# EAGLE design device (EAGLE 6.6.0)
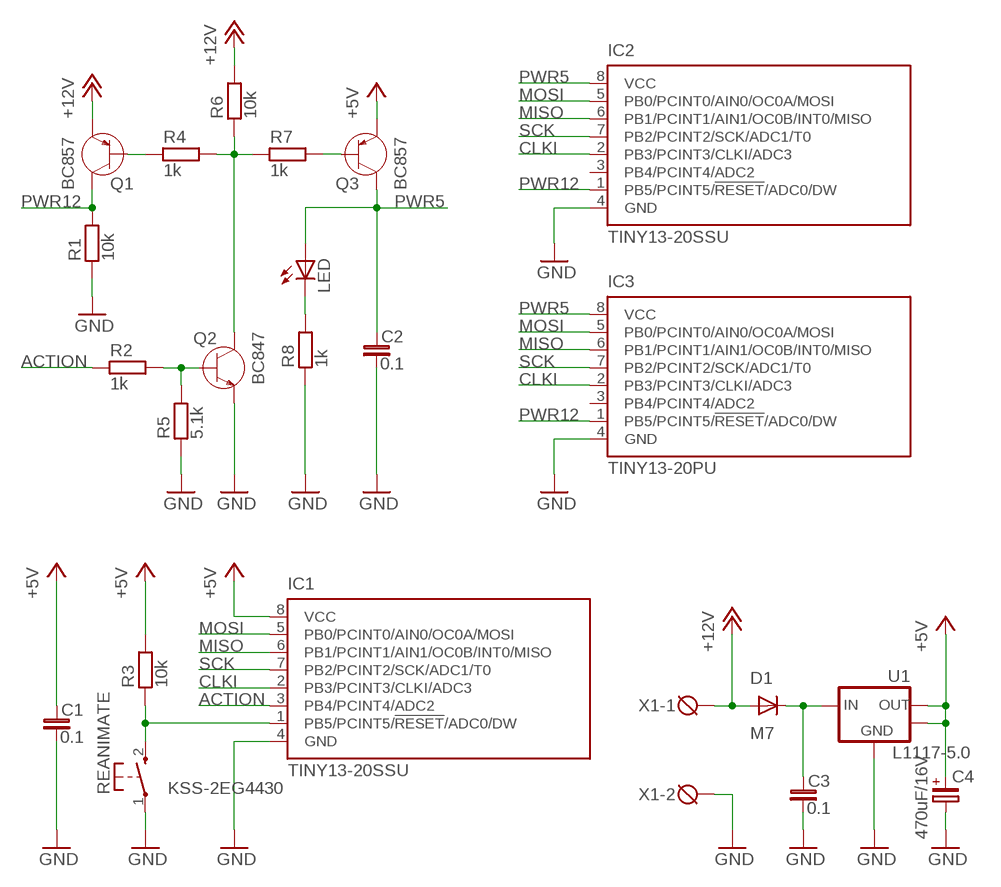
[diagram p0: schematic, sheet 1]

## Parts
C1  0.1  C_0805  [C0805]
C2  0.1  C_0805  [C0805]
C3  0.1  C_0805  [C0805]
C4  470uF/16V  CP_BC175TMP-0810  [C175TMP-0810]
D1  M7  DIODE-DO214AC  [DO214AC]
IC1  TINY13-20SSU  [8S1]
IC2  TINY13-20SSU  [8S1]
IC3  TINY13-20PU  [DIL08]
LED  LEDCHIPLED_0805  [CHIPLED_0805]
Q1  BC857  PNP-SOT23  [SOT23]
Q2  BC847  NPN-SOT23  [SOT23]
Q3  BC857  PNP-SOT23  [SOT23]
R1  10k  R_0805  [R0805]
R2  1k  R_0805  [R0805]
R3  10k  R_0805  [R0805]
R4  1k  R_0805  [R0805]
R5  5.1k  R_0805  [R0805]
R6  10k  R_0805  [R0805]
R7  1k  R_0805  [R0805]
R8  1k  R_0805  [R0805]
REANIMATE  KSS-2EG4430  [KSS-2EG4430]
U1  L1117-5.0  LM1117-3.3  [SOT223]
X1  DG3XX-02-5.0  [DG306-5.0-02P]

## Nets
+5V: C1.1 C4.+ IC1.8(VCC) Q3.2(E) R3.2 U1.2(OUT) U1.4(MASS)
+12V: D1.A Q1.2(E) R6.2 X1.1
ACTION: IC1.3(PB4/PCINT4/ADC2) R2.1
CLKI: IC1.2(PB3/PCINT3/CLKI/ADC3) IC2.2(PB3/PCINT3/CLKI/ADC3) IC3.2(PB3/PCINT3/CLKI/ADC3)
GND: C1.2 C2.2 C3.2 C4.- IC1.4(GND) IC2.4(GND) IC3.4(GND) Q2.2(E) R1.1 R5.1 R8.1 REANIMATE.1(P) U1.1(GND) X1.2
MISO: IC1.6(PB1/PCINT1/AIN1/OC0B/INT0/MISO) IC2.6(PB1/PCINT1/AIN1/OC0B/INT0/MISO) IC3.6(PB1/PCINT1/AIN1/OC0B/INT0/MISO)
MOSI: IC1.5(PB0/PCINT0/AIN0/OC0A/MOSI) IC2.5(PB0/PCINT0/AIN0/OC0A/MOSI) IC3.5(PB0/PCINT0/AIN0/OC0A/MOSI)
N$1: IC1.1(PB5/PCINT5/!RESET!/ADC0/DW) R3.1 REANIMATE.2(S)
N$2: C3.1 D1.C U1.3(IN)
N$3: Q2.1(B) R2.2 R5.2
N$4: Q1.1(B) R4.1
N$5: Q3.1(B) R7.2
N$6: LED.C R8.2
N$8: Q2.3(C) R4.2 R6.1 R7.1
PWR5: C2.1 IC2.8(VCC) IC3.8(VCC) LED.A Q3.3(C)
PWR12: IC2.1(PB5/PCINT5/!RESET!/ADC0/DW) IC3.1(PB5/PCINT5/!RESET!/ADC0/DW) Q1.3(C) R1.2
SCK: IC1.7(PB2/PCINT2/SCK/ADC1/T0) IC2.7(PB2/PCINT2/SCK/ADC1/T0) IC3.7(PB2/PCINT2/SCK/ADC1/T0)
Unconnected: IC2.3(PB4/PCINT4/ADC2) IC3.3(PB4/PCINT4/ADC2)

## Library data of the parts
C1-C3 = rc-master-smd:C_: NON-POLARIZED CAP
C4 = rc-master:CP_: POLARIZED CAP
D1 = diode:DIODE-: DIODE
IC1-IC3 = avr:TINY13: 8-bit AVR Microcontroller with 1K Bytes In-System Programmable Flash Source: http://www.atmel.com/dyn/resources/prod_documents/2535S.pdf
LED = led:LED: LED OSRAM: - CHIPLED LG R971, LG N971, LY N971, LG Q971, LY Q971, LO R971, LY R971 LH N974, LH R974 LS Q976, LO Q976, LY Q976 LO Q996 - Hyper CHIPLED LW Q18S LB Q993, LB Q99A, LB R99A - SideLED LS A670, LO A670, LY A670, LG A670, LP A670 LB A673, LV A673, LT A673, LW A673 LH A674 LY A675 LS A676, LA A676, LO A676, LY A676, LW A676 LS A679, LY A679, LG A679 - Hyper Micro SIDELED® LS Y876, LA Y876, LO Y876, LY Y876 LT Y87S - SmartLED LW L88C, LW L88S LB L89C, LB L89S, LG L890 LS L89K, LO L89K, LY L89K LS L896, LA L896, LO L896, LY L896 - TOPLED LS T670, LO T670, LY T670, LG T670, LP T670 LSG T670, LSP T670, LSY T670, LOP T670, LYG T670 LG T671, LOG T671, LSG T671 LB T673, LV T673, LT T673, LW T673 LH T674 LS T676, LA T676, LO T676, LY T676, LB T676, LH T676, LSB T676, LW T676 LB T67C, LV T67C, LT T67C, LS T67K, LO T67K, LY T67K, LW E67C LS E67B, LA E67B, LO E67B, LY E67B, LB E67C, LV E67C, LT E67C LW T67C LS T679, LY T679, LG T679 LS T770, LO T770, LY T770, LG T770, LP T770 LB T773, LV T773, LT T773, LW T773 LH T774 LS E675, LA E675, LY E675, LS T675 LS T776, LA T776, LO T776, LY T776, LB T776 LHGB T686 LT T68C, LB T68C - Hyper Mini TOPLED® LB M676 - Mini TOPLED Santana® LG M470 LS M47K, LO M47K, LY M47K Source: http://www.osram.convergy.de - LUMILED® LXK2-PW12-R00, LXK2-PW12-S00, LXK2-PW14-U00, LXK2-PW14-V00 LXK2-PM12-R00, LXK2-PM12-S00, LXK2-PM14-U00 LXK2-PE12-Q00, LXK2-PE12-R00, LXK2-PE12-S00, LXK2-PE14-T00, LXK2-PE14-U00 LXK2-PB12-K00, LXK2-PB12-L00, LXK2-PB12-M00, LXK2-PB14-N00, LXK2-PB14-P00, LXK2-PB14-Q00 LXK2-PR12-L00, LXK2-PR12-M00, LXK2-PR14-Q00, LXK2-PR14-R00 LXK2-PD12-Q00, LXK2-PD12-R00, LXK2-PD12-S00 LXK2-PH12-R00, LXK2-PH12-S00 LXK2-PL12-P00, LXK2-PL12-Q00, LXK2-PL12-R00 Source: www.luxeon.com
Q1 Q3 = semiconductor:PNP-
Q2 = semiconductor:NPN-: Bipolar transistor NPN-structure
R1-R8 = rc-master-smd:R_: RESISTOR
REANIMATE = buttons:KSS-2EG4430: Size: 3x6mm Height: 5mm from PCB Rating: DC12v 50mA Travel: 0.25±0.10mm Operating Force: 180±50gf Return Force: 60gf min Contact resistance: 100m? max Insulation resistance: 100M? min Operating life?50,000 cycles
U1 = vreg-linear:LM1117: Linear regulators
X1 = degson:DG3XX-02: DG350-3.5-02P DG306-5.0-02P

## Net classes
0 default: clearance 0.2 mm

## Board
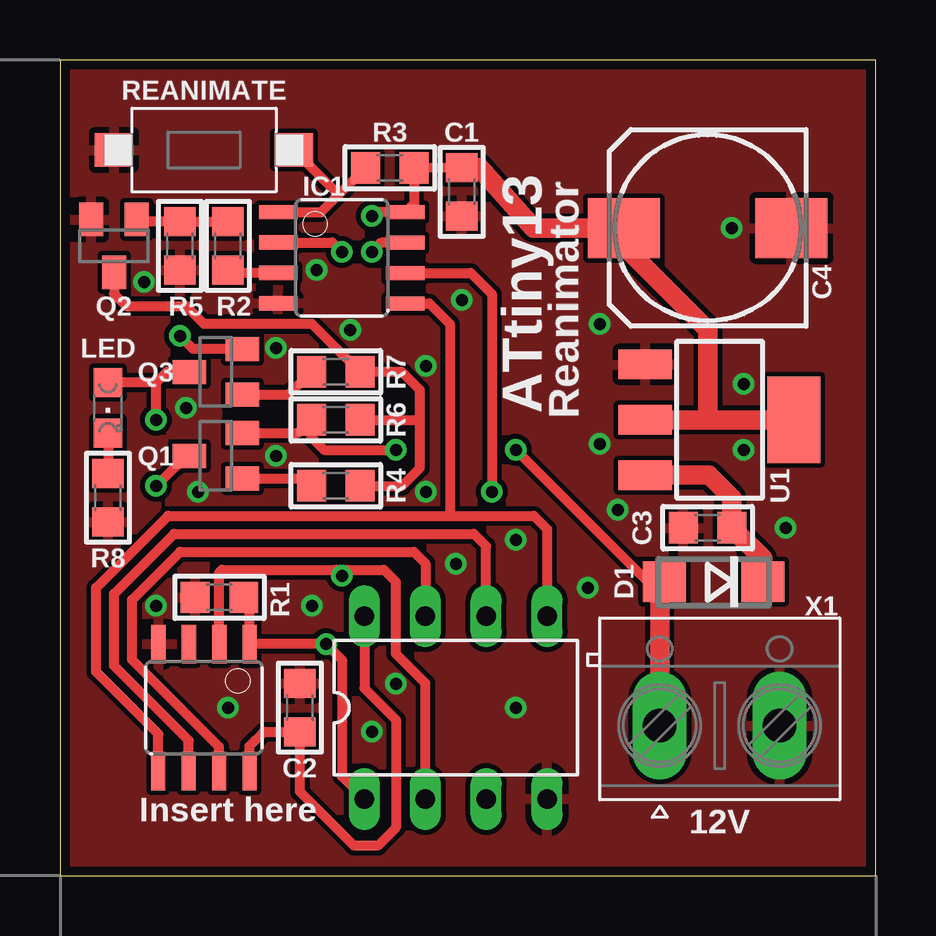
[diagram p1: board, top side]
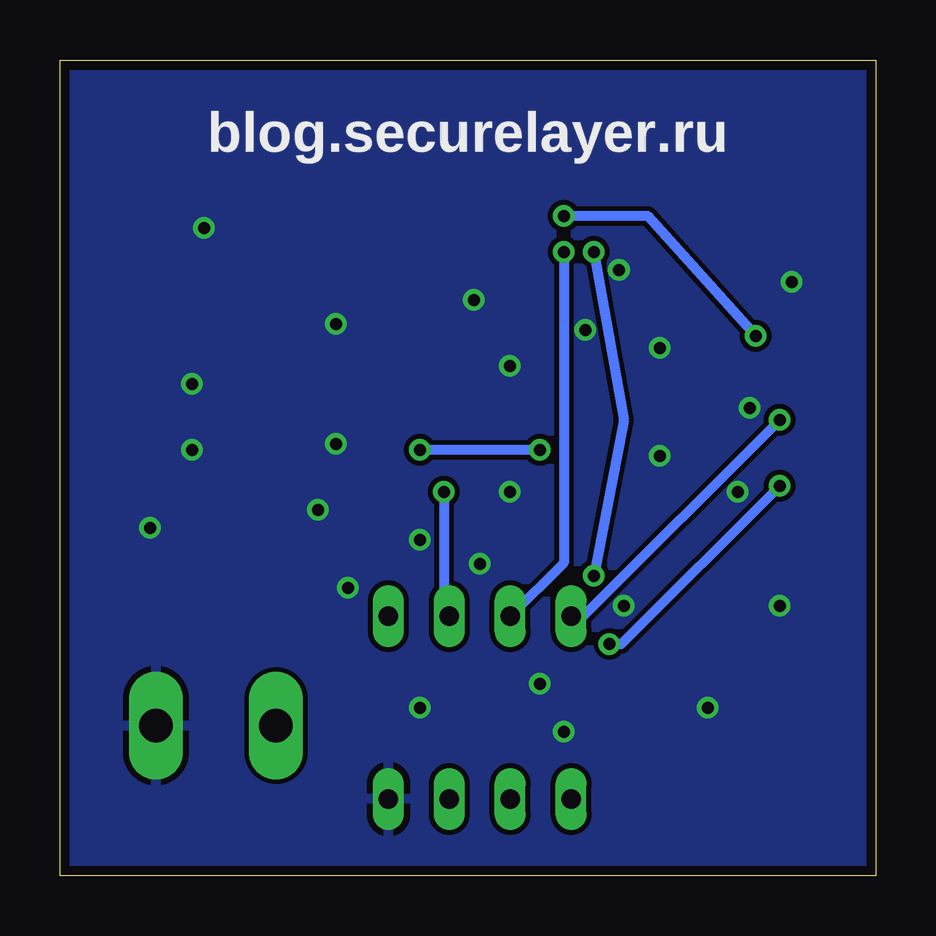
[diagram p2: board, bottom side, seen from below]

Size 34 x 34 mm. Coordinates in mm from the lower left corner, seen from the top.
Outline: 0,0 34,0 34,34 0,34 0,0
Copper layers (1*16): Top 0.018mm / dielectric 1.5011mm / Bottom 0.018mm
Design rules "tepro-speed-18mkm": minimum track width 0.2mm, minimum drill 0.4mm, track to track 0.2mm, track to pad 0.2mm, pad to pad 0.2mm, via to via 0.2mm, smd to smd 0.2mm, copper to edge 0.4mm, drill to drill 0.4mm, minimum pad ring 0.2mm, minimum via ring 0.2mm, stop-mask expansion 4mil, vias tented up to drill 0.2mm, thermal gap 10mil

### Footprints (pad centres in the part's own frame; a part is rotated, then mirrored left to right if it is on the bottom)
C0805 = smd 1.2 x 1.3: 1 -1.016,0; 2 1.016,0
C175TMP-0810 = smd 3 x 2.5: + 3.493,0; - -3.493,0
DO214AC = smd 1.8 x 1.7: A 2.05,0; C -2.05,0
8S1 = smd 0.6 x 1.6: 1 -1.905,-2.654; 2 -0.645,-2.654; 3 0.625,-2.654; 4 1.895,-2.654; 5 1.905,2.654; 6 0.635,2.654; 7 -0.635,2.654; 8 -1.905,2.654
DIL08 = drill 0.813 long: 1 -3.81,-3.81; 2 -1.27,-3.81; 3 1.27,-3.81; 4 3.81,-3.81; 5 3.81,3.81; 6 1.27,3.81; 7 -1.27,3.81; 8 -3.81,3.81
CHIPLED_0805 = smd 1.2 x 1.2: A 0,-1.05; C 0,1.05
SOT23 = smd 1 x 1.4: 1 -0.95,-1.1; 2 0.95,-1.1; 3 0,1.1
R0805 = smd 1.2 x 1.3: 1 -1.016,0; 2 1.016,0
KSS-2EG4430 = smd 1.6 x 1.4: 1 -3.75,0; 2 3.75,0
SOT223 = smd 1.219 x 2.235: 1 -2.311,-3.099; 2 0,-3.099; 3 2.311,-3.099 | smd 3.6 x 2.2: 4 0,3.099
DG306-5.0-02P = drill 1.4 long: 1 -2.5,0; 2 2.5,0

### Placement (x,y rotation side)
C1  16.75,28.5 270 top
C2  10,7 90 top
C3  27,14.5 180 top
C4  27,27 180 top
D1  27.25,12.25 180 top
IC1  11.75,25.75 270 top
IC2  6,7 180 top
IC3  16.5,7 0 top
LED  2,19.5 180 top
Q1  6.5,17.5 90 top
Q2  2.25,26.25 180 top
Q3  6.5,21 90 top
R1  6.65,11.6 0 top
R2  7,26.25 90 top
R3  13.75,29.5 0 top
R4  11.5,16.25 0 top
R5  5,26.25 90 top
R6  11.5,19 180 top
R7  11.5,21 180 top
R8  2,15.75 90 top
REANIMATE  6,30.25 0 top
U1  27.5,19 270 top
X1  27.5,6.25 0 top

### Tracks (layer width: path | path; a pad name or v marks a point on that pad's centre or on a via)
+5V  (via drill 0.5)
  Top 0.406: v13,27.5 13.15,27.66 IC1.8 14.77,28.02 R3.2 14.78,29.48 C1.1 | Q3.2 5.55,21.95 v5,22.5
  Top 0.813: U1.4 27,19 | 27,19 U1.2 | 27,19 27,22.75 23.51,26.24 C4.+ 19.73,27 17.5,29.5 17.48,29.52 C1.1
  Bottom 0.406: v5,22.5 9.5,27.5 v13,27.5
+12V  (via drill 0.5)
  Top 0.406: Q1.2 9.93,18.45 R6.2 10.48,18.27 11,17.75 v14,17.75 | v19,17.75 24.5,12.25 D1.A
  Top 0.813: X1.1 25,12.05 D1.A
  Bottom 0.406: v14,17.75 v19,17.75
ACTION
  Top 0.406: IC1.3 7.11,25.12 R2.1
CLKI  (via drill 0.5)
  Top 0.406: IC3.2 15.23,8.02 14,9.25 14,12.25 13.5,12.75 12,12.75 v11.75,12.5 11.5,12.75 6.75,12.75 6.64,12.64 IC2.2 | IC1.2 11.36,26.39 v11.75,26
  Bottom 0.406: v11.75,26 10.5,19 v11.75,12.5
GND  (via drill 0.5)
  other vias: 10.7,25.25 9,22 3.5,24.75 5.25,19.5 7,7 14,8 10.5,11.25 19,7 16.5,13 19,14 13,6 15.25,16 15.25,21.25 16.75,24 9,17.5 28.5,17.75 22,12 30.25,14.5 23.25,15.25 28.5,20.5 28,27 22.5,23 22.5,18 4,11.25 12.1,22.75 5.75,16
  pour Top: 0,0 34,0 34,34 0,34
  pour Bottom: 0,0 34,0 34,34 0,34
MISO  (via drill 0.5)
  Top 0.406: IC2.6 5.37,5.63 2.25,8.75 2.25,11.75 4.75,14.25 17.25,14.25 17.77,13.73 IC3.6 | IC1.6 17.14,25.11 18,24.25 v18,16
  Bottom 0.406: v18,16 18,11.04 IC3.6
MOSI
  Top 0.406: IC2.5 4.09,5.91 1.5,8.5 1.5,12 4.5,15 16.25,15 | 16.25,15 19.75,15 20.31,14.44 IC3.5 | IC1.5 15.4,23.84 16.25,23 16.25,15
N$1
  Top 0.406: IC1.1 10.89,27.66 11.62,28.38 | 11.62,28.38 R3.1 | REANIMATE.2 11.62,28.38
N$2
  Top 0.813: U1.3 27.06,16.69 28,15.75 28,14.52 C3.1 29.3,13.22 D1.C
N$3
  Top 0.406: R2.2 R5.2 3.28,27.27 Q2.1
N$4
  Top 0.406: Q1.1 10.18,16.55 R4.1
N$5
  Top 0.406: Q3.1 9.53,20.05 R7.2
N$6
  Top 0.406: LED.C R8.2
N$8
  Top 0.406: R4.2 14.25,16.25 15,17 15,19 | 15,19 15,20.25 14.25,21 R7.1 12.5,21 10.5,23 6,23 5.25,23.75 2.75,23.75 2.25,24.25 Q2.3 | R6.1 15,19
PWR5  (via drill 0.5)
  Top 0.406: IC2.8 7.91,5.41 8.5,6 9.98,6 C2.1 10,3.5 12.25,1.25 13.25,1.25 14,2 14,6.5 12.69,7.81 IC3.8 | v4,19 4,20.55 | 4,20.55 LED.A | Q3.3 4.45,21 4,20.55
  Bottom 0.406: IC3.8 12.19,10.81 v4,19
PWR12  (via drill 0.5)
  Top 0.406: IC3.1 11.75,4.13 11.75,9 v11.1,9.65 IC2.1 7.91,11.36 R1.2 | Q1.3 4.75,17 v4,16.25
  Bottom 0.406: v11.1,9.65 10.6,9.65 v4,16.25
SCK  (via drill 0.5)
  Top 0.406: IC2.7 6.63,5.37 3,9 3,11.5 5,13.5 14.75,13.5 15.23,13.02 IC3.7 | IC1.7 13.38,26.39 v13,26
  Bottom 0.406: v13,26 13,13.04 IC3.7

### Text on the board
tNames: ATtiny13 | Reanimator | Insert here | 12V
bNames: blog.securelayer.ru